# Altium schematic sheet LineSensorSchematic.SchDoc: EEE3061W Design Project Line Sensor
size A4; DrawnBy: Team 13; DocumentNumber: 2; Revision: 1
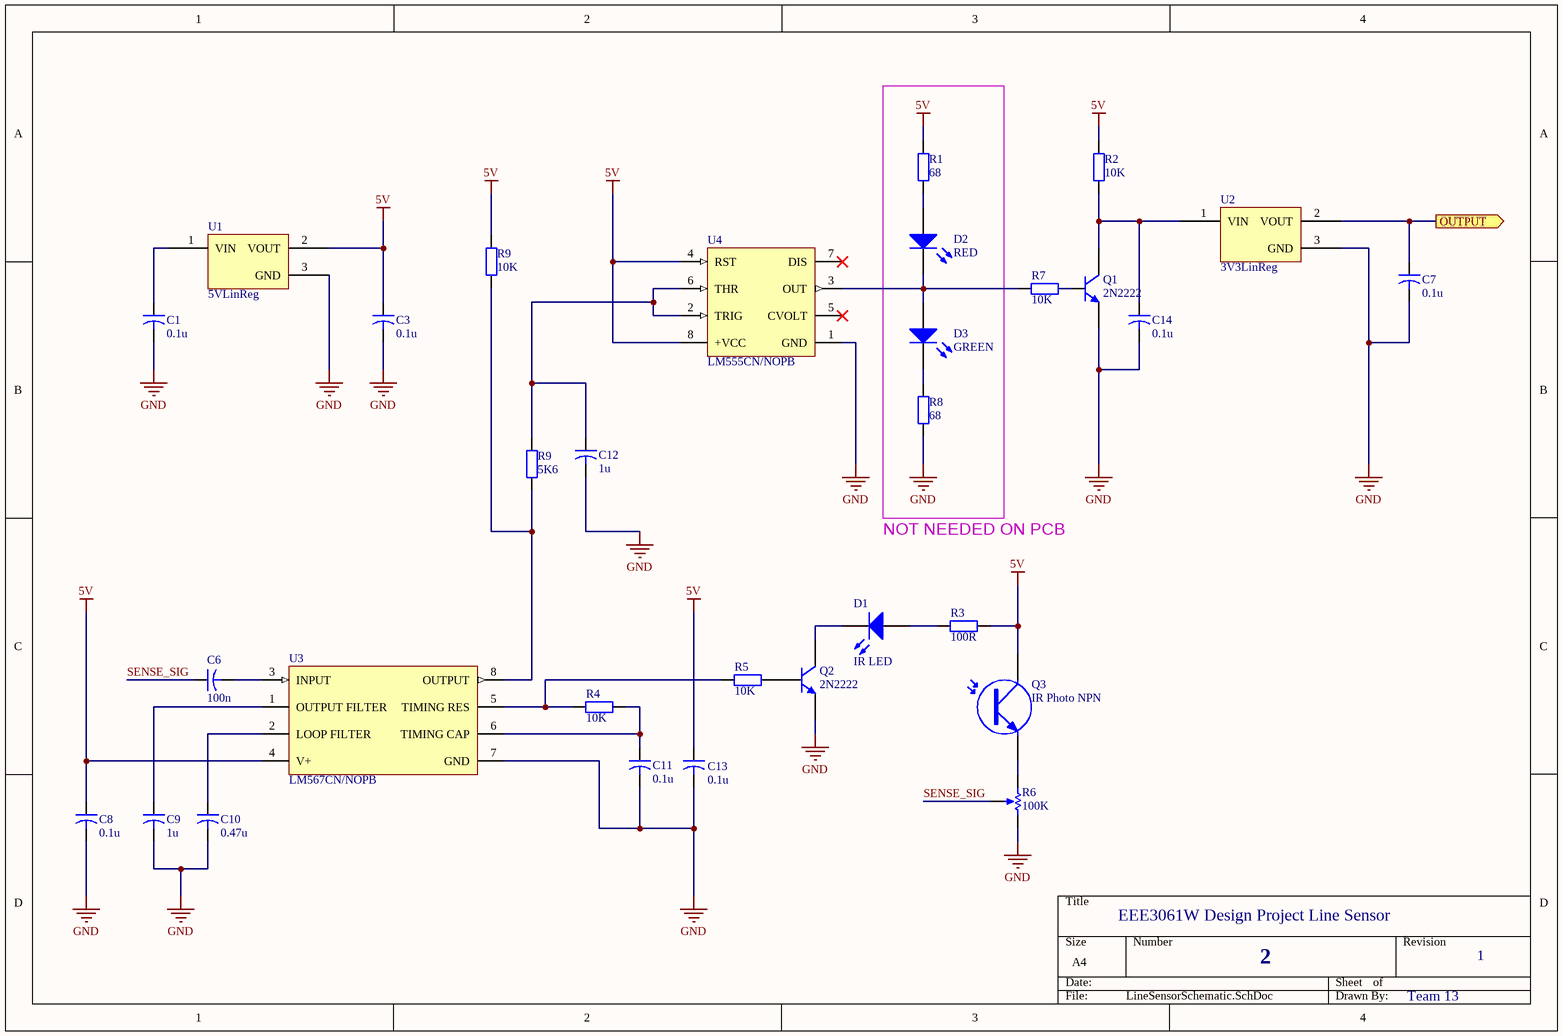
[diagram p0: LineSensorSchematic.SchDoc]

## Parts
(Parts that share a designator on the sheet are numbered #1, #2 ... from top to bottom, then left to right.)
C1  0.1u  [CAPR5-4X5]
C3  0.1u  [CAPR5-4X5]
C6  100n  [CAPR5-4X5]
C7  0.1u  [CAPR5-4X5]
C8  0.1u  [CAPR5-4X5]
C9  1u  [CAPR5-4X5]
C10  0.47u  [CAPR5-4X5]
C11  0.1u  [CAPR5-4X5]
C12  1u  [CAPR5-4X5]
C13  0.1u  [CAPR5-4X5]
C14  0.1u  [CAPR5-4X5]
D1  IR LED  [LED-0]
D2  RED  [LED-0]
D3  GREEN  [LED-0]
Q1  2N2222  [TO-226-AA]
Q2  2N2222  [TO-226-AA]
Q3  IR Photo NPN  [TO-220_A]
R1  68  [AXIAL-0.4]
R2  10K  [AXIAL-0.4]
R3  100R  [AXIAL-0.4]
R4  10K  [AXIAL-0.4]
R5  10K  [AXIAL-0.4]
R6  100K  [VR5]
R7  10K  [AXIAL-0.4]
R8  68  [AXIAL-0.4]
R9#1  10K  [AXIAL-0.4]
R9#2  5K6  [AXIAL-0.4]
U1  5VLinReg  [TO-92Wide]
U2  3V3LinReg  [TO-92Wide]
U3  LM567CN/NOPB  [N08E]
U4  LM555CN/NOPB  [N08E]

## Ports
OUTPUT (out)

## Nets
5V: C3.1 C8.1 C13.1 Q3.1(C) R1.2 R2.2 R3.1 R9#1.1 U1.2(VOUT) U3.4(V+) U4.4(RST) U4.8(+VCC)
GND: C1.2 C3.2 C7.2 C8.2 C9.2 C10.2 C11.2 C12.2 C13.2 C14.2 Q1.3(E) Q2.3(E) R6.2(BOT) R8.1 U1.3(GND) U2.3(GND) U3.7(GND) U4.1(GND)
OUTPUT: C7.1 U2.2(VOUT) ; port OUTPUT
SENSE_SIG: C6.1 R6.3(TAP)
NetC1_1: C1.1 U1.1(VIN)
NetC6_2: C6.2 U3.3(INPUT)
NetC9_1: C9.1 U3.1(OUTPUT_FILTER)
NetC10_1: C10.1 U3.2(LOOP_FILTER)
NetC11_1: C11.1 R4.1 U3.6(TIMING_CAP)
NetC12_1: C12.1 R9#2.1 U4.2(TRIG) U4.6(THR)
NetC14_1: C14.1 Q1.1(C) R2.1 U2.1(VIN)
NetD1_1: D1.1(A) R3.2
NetD1_2: D1.2(K) Q2.1(C)
NetD2_1: D2.1(A) R1.1
NetD2_2: D2.2(K) D3.1(A) R7.2 U4.3(OUT)
NetD3_2: D3.2(K) R8.2
NetQ1_2: Q1.2(B) R7.1
NetQ2_2: Q2.2(B) R5.1
NetQ3_3: Q3.3(E) R6.1(TOP)
NetR4_2: R4.2 R5.2 U3.5(TIMING_RES)
NetR9#1_2: R9#1.2 R9#2.2 U3.8(OUTPUT)

Not connected (* = marked no-connect by the designer): U4 5(CVOLT)* 7(DIS)*

## Notes on the sheet
- NOT NEEDED ON PCB

## Library data of the parts
C1 C3 C6-C14 = Cap2: Capacitor; Published: 23-Sep-2002; PackageReference: CAPR5-4X5; Publisher: Altium Limited; PackageDescription: Capacitor; 2 Leads
  C1 C3 C7 C8 C11 C13 C14: Value: 0.1u
  C6: Value: 100n
  C9 C12: Value: 1u
  C10: Value: 0.47u
D1-D3 = LED0: Typical INFRARED GaAs LED; Published: 8-Jun-2000; LatestRevisionDate: 08-Jul-2005; LatestRevisionNote: Mech Layer 1 removed.; PackageReference: LED-0; Publisher: Altium Limited; PackageDescription: LED; 2 Leads
Q1 Q2 = NPN: NPN Bipolar Transistor; Published: 8-Jun-2000; LatestRevisionDate: 17-Jul-2002; LatestRevisionNote: Re-released for DXP Platform.; PackageReference: TO-226-AA; Publisher: Altium Limited; PackageDescription: TO, Flat Index; 3 In-Line, Axial Leads; Body Dia. 4.8mm; Leads 0.55 x 0.51 mm (max); Code_JEDEC: TO-226-AA
Q3 = Photo NPN: NPN Phototransistor; Published: 24-Mar-1999; LatestRevisionDate: 17-Jul-2002; LatestRevisionNote: Re-released for DXP Platform.; PackageReference: TO-220_A; Publisher: Altium Limited; Code_JEDEC: TO-220-AC
R1-R5 R7 R8 R9#1 R9#2 = Res2: Resistor; Published: 8-Jun-2000; LatestRevisionDate: 17-Jul-2002; LatestRevisionNote: Re-released for DXP Platform.; PackageReference: AXIAL-0.4; Publisher: Altium Limited; PackageDescription: Axial Device, Thru-Hole; 2 Leads; 0.4 in Pin Spacing
  R1 R8: Value: 68
  R2 R4 R5 R7 R9#1: Value: 10K
  R3: Value: 100R
  R9#2: Value: 5K6
R6 = RPot: Potentiometer; Sim Note: Enter the Resistance value and the set point into parameter fields.; Set Position: 0.5; Published: 8-Jun-2000; LatestRevisionDate: 17-Jul-2002; LatestRevisionNote: Re-released for DXP Platform.; PackageReference: VR5; Publisher: Altium Limited; PackageDescription: Variable Resistor, Thru-Hole; 3 Leads; Value: 100K
U1 U2 = VREG5V: MCP
U3 = CMP-0057-00046-2: Tone Decoder, 8-pin MDIP, Pb-Free; Manufacturer: National Semiconductor; CompType: Audio IC; PackageTopMarking: NSUZXYTTE#*LM*567CN; PowerWise: N; RevisionNote: Component URLs added; ComponentLink3URL: http://www.national.com/packaging/folders/n08e.html; ComponentLink1URL: http://www.national.com/ds/LM/LM567C.pdf; ComponentLink2URL: http://www.national.com/pf/LM/LM567C.html; ComponentLink2Description: LM567C Web Page; PackageDescription: MDIP, .365 x .250 x .130in, 8 Lead, .100in Pitch; PinCount: 8; Code_JEDEC: MS-001-BA; ComponentLink3Description: N08E Package Page; DatasheetVersion: Feb-2003; RoHS: Y; PackageReference: N08E; ComponentLink1Description: LM567C Datasheet; PackageVersion: revG, May-2006
U4 = CMP-0056-00016-2: Timer, 8-pin MDIP, Pb-Free; Manufacturer: National Semiconductor; CompType: Analog IC; PowerWise: N; PackageTopMarking: NSUZXYTTE#*LM*555CN; ComponentLink3Description: N08E Package Page; ComponentLink3URL: http://www.national.com/packaging/folders/n08e.html; ComponentLink1URL: http://www.national.com/ds/LM/LM555.pdf; PackageVersion: revG, May-2006; PackageDescription: MDIP, .365 x .250 x .130in, 8 Lead, .100in Pitch; ComponentLink1Description: LM555 Datasheet; RevisionNote: Component URLs added; ComponentLink2URL: http://www.national.com/pf/LM/LM555.html; RoHS: Y; Code_JEDEC: MS-001-BA; DatasheetVersion: Jul-2006; PackageReference: N08E; PinCount: 8; ComponentLink2Description: LM555 Web Page